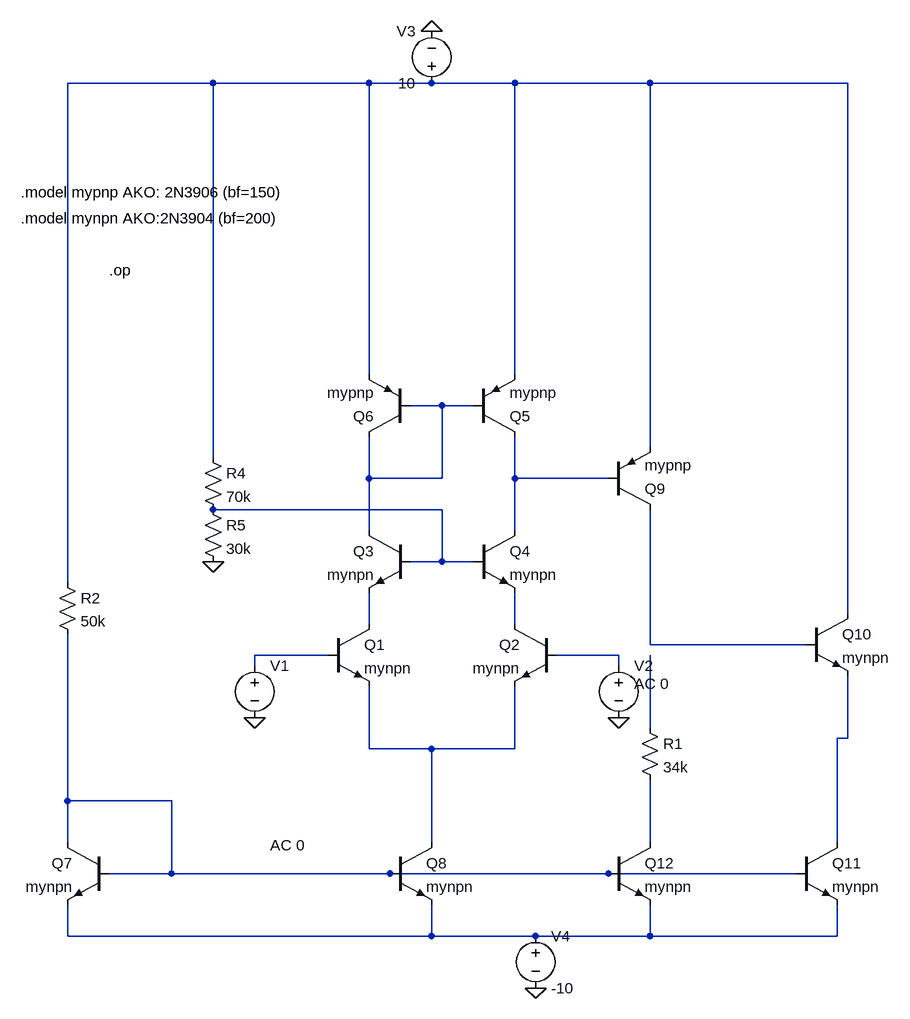
[diagram p0: schematic Ph1_circuit.asc]
Ph1_circuit.asc, the LTspice schematic file:
Version 4
SHEET 1 1220 736
WIRE -64 -720 -288 -720
WIRE 176 -720 -64 -720
WIRE 272 -720 176 -720
WIRE 400 -720 272 -720
WIRE 608 -720 400 -720
WIRE 912 -720 608 -720
WIRE 176 -272 176 -720
WIRE 400 -272 400 -720
WIRE 288 -224 240 -224
WIRE 336 -224 288 -224
WIRE 608 -160 608 -720
WIRE -64 -144 -64 -720
WIRE 176 -112 176 -176
WIRE 288 -112 288 -224
WIRE 288 -112 176 -112
WIRE 400 -112 400 -176
WIRE 544 -112 400 -112
WIRE 288 -64 -64 -64
WIRE 176 -32 176 -112
WIRE 400 -32 400 -112
WIRE 288 16 288 -64
WIRE 288 16 240 16
WIRE 336 16 288 16
WIRE -288 48 -288 -720
WIRE 912 96 912 -720
WIRE 176 112 176 64
WIRE 400 112 400 64
WIRE 608 144 608 -64
WIRE 848 144 608 144
WIRE 112 160 0 160
WIRE 560 160 464 160
WIRE 0 176 0 160
WIRE 560 176 560 160
WIRE 608 272 608 160
WIRE 912 288 912 192
WIRE 912 288 896 288
WIRE 176 304 176 208
WIRE 272 304 176 304
WIRE 400 304 400 208
WIRE 400 304 272 304
WIRE -288 384 -288 128
WIRE -128 384 -288 384
WIRE -288 448 -288 384
WIRE 272 448 272 304
WIRE 608 448 608 352
WIRE 896 448 896 288
WIRE -128 496 -128 384
WIRE -128 496 -224 496
WIRE 208 496 -128 496
WIRE 544 496 208 496
WIRE 832 496 544 496
WIRE -288 592 -288 544
WIRE 272 592 272 544
WIRE 272 592 -288 592
WIRE 432 592 272 592
WIRE 608 592 608 544
WIRE 608 592 432 592
WIRE 896 592 896 544
WIRE 896 592 608 592
FLAG 0 256 0
FLAG 560 256 0
FLAG 432 672 0
FLAG 272 -800 0
FLAG -64 16 0
SYMBOL npn 112 112 R0
SYMATTR InstName Q1
SYMATTR Value mynpn
SYMBOL npn 464 112 M0
SYMATTR InstName Q2
SYMATTR Value mynpn
SYMBOL npn 240 -32 M0
SYMATTR InstName Q3
SYMATTR Value mynpn
SYMBOL npn 336 -32 R0
SYMATTR InstName Q4
SYMATTR Value mynpn
SYMBOL pnp 336 -176 M180
SYMATTR InstName Q5
SYMATTR Value mypnp
SYMBOL pnp 240 -176 R180
SYMATTR InstName Q6
SYMATTR Value mypnp
SYMBOL voltage 0 160 R0
WINDOW 3 24 264 Left 2
WINDOW 123 24 292 Left 2
WINDOW 39 0 0 Left 0
SYMATTR InstName V1
SYMATTR Value ""
SYMATTR Value2 AC 0
SYMBOL npn 208 448 R0
SYMATTR InstName Q8
SYMATTR Value mynpn
SYMBOL npn -224 448 M0
SYMATTR InstName Q7
SYMATTR Value mynpn
SYMBOL voltage 272 -704 R180
WINDOW 0 24 96 Left 2
WINDOW 3 24 16 Left 2
WINDOW 123 0 0 Left 0
WINDOW 39 0 0 Left 0
SYMATTR InstName V3
SYMATTR Value 10
SYMBOL voltage 432 576 R0
WINDOW 123 0 0 Left 0
WINDOW 39 0 0 Left 0
SYMATTR InstName V4
SYMATTR Value -10
SYMBOL res -304 32 R0
SYMATTR InstName R2
SYMATTR Value 50k
SYMBOL npn 848 96 R0
SYMATTR InstName Q10
SYMATTR Value mynpn
SYMBOL npn 832 448 R0
SYMATTR InstName Q11
SYMATTR Value mynpn
SYMBOL npn 544 448 R0
SYMATTR InstName Q12
SYMATTR Value mynpn
SYMBOL pnp 544 -64 M180
SYMATTR InstName Q9
SYMATTR Value mypnp
SYMBOL res -80 -160 R0
SYMATTR InstName R4
SYMATTR Value 70k
SYMBOL res -80 -80 R0
SYMATTR InstName R5
SYMATTR Value 30k
SYMBOL voltage 560 160 R0
WINDOW 3 24 264 Left 2
WINDOW 123 24 44 Left 2
WINDOW 39 0 0 Left 0
SYMATTR InstName V2
SYMATTR Value ""
SYMATTR Value2 AC 0
SYMBOL res 592 256 R0
SYMATTR InstName R1
SYMATTR Value 34k
TEXT -360 -552 Left 2 !.model mypnp AKO: 2N3906 (bf=150)
TEXT -360 -512 Left 2 !.model mynpn AKO:2N3904 (bf=200)
TEXT -224 -432 Left 2 !.op

The netlist it stands for:
* Ph1_circuit.asc
Q1 N005 N008 N012 0 mynpn
Q2 N006 N009 N012 0 mynpn
Q3 N002 N004 N005 0 mynpn
Q4 N003 N004 N006 0 mynpn
Q5 N003 N002 N001 0 mypnp
Q6 N002 N002 N001 0 mypnp
V1 N008 0 AC 0
Q8 N012 N013 N015 0 mynpn
Q7 N013 N013 N015 0 mynpn
V3 N001 0 10
V4 N015 0 -10
R2 N001 N013 50k
Q10 N001 N007 N011 0 mynpn
Q11 N011 N013 N015 0 mynpn
Q12 N014 N013 N015 0 mynpn
Q9 N007 N003 N001 0 mypnp
R4 N001 N004 70k
R5 N004 0 30k
V2 N009 0 AC 0
R1 N010 N014 34k
.model NPN NPN
.model PNP PNP
.lib standard.bjt
.model mypnp AKO: 2N3906 (bf=150)
.model mynpn AKO:2N3904 (bf=200)
.op
.backanno
.end